# EAGLE schematic Spring Terminal OST (EAGLE 7.1.0)
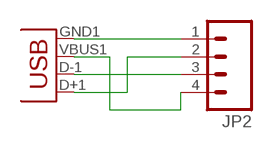
[diagram p0: schematic, sheet 1]

## Parts
JP1  USB  [USB-B-MICRO-SMD_V03]
JP2  M04OSTSPRINGTERM  [1X04_SPRING_TERMINAL]

## Nets
3V3: JP1.VBUS1(VBUS) JP2.4
D+: JP1.D+1(D+) JP2.2
D-: JP1.D-1(D-) JP2.3
GND: JP1.GND1(GND) JP2.1

## Library data of the parts
JP1 = SparkFun-Connectors:USB: USB Connectors USB-B-PTH is fully proven SKU : PRT-00139/CONN-08278 USB-miniB is fully proven SKU : PRT-00587 USB-A-PCB is untested. USB-A-H is throughly reviewed, but untested. Spark Fun Electronics SKU : PRT-00437 USB-B-SMT is throughly reviewed, but untested. Needs silkscreen touching up. USB-A-S has not been used/tested USB-MB-H has not been used/tested USB-MICROB has been used. CONN-09505
JP2 = SparkFun-Connectors:M04: Header 4 Standard 4-pin 0.1" header. Use with straight break away headers (SKU : PRT-00116), right angle break away headers (PRT-00553), swiss pins (PRT-00743), machine pins (PRT-00117), and female headers (PRT-00115). Molex polarized connector foot print use with SKU : PRT-08231 with associated crimp pins and housings. 1MM SMD Version SKU: PRT-10208